# EAGLE schematic i2-mb_r2 (EAGLE 6.5.0)
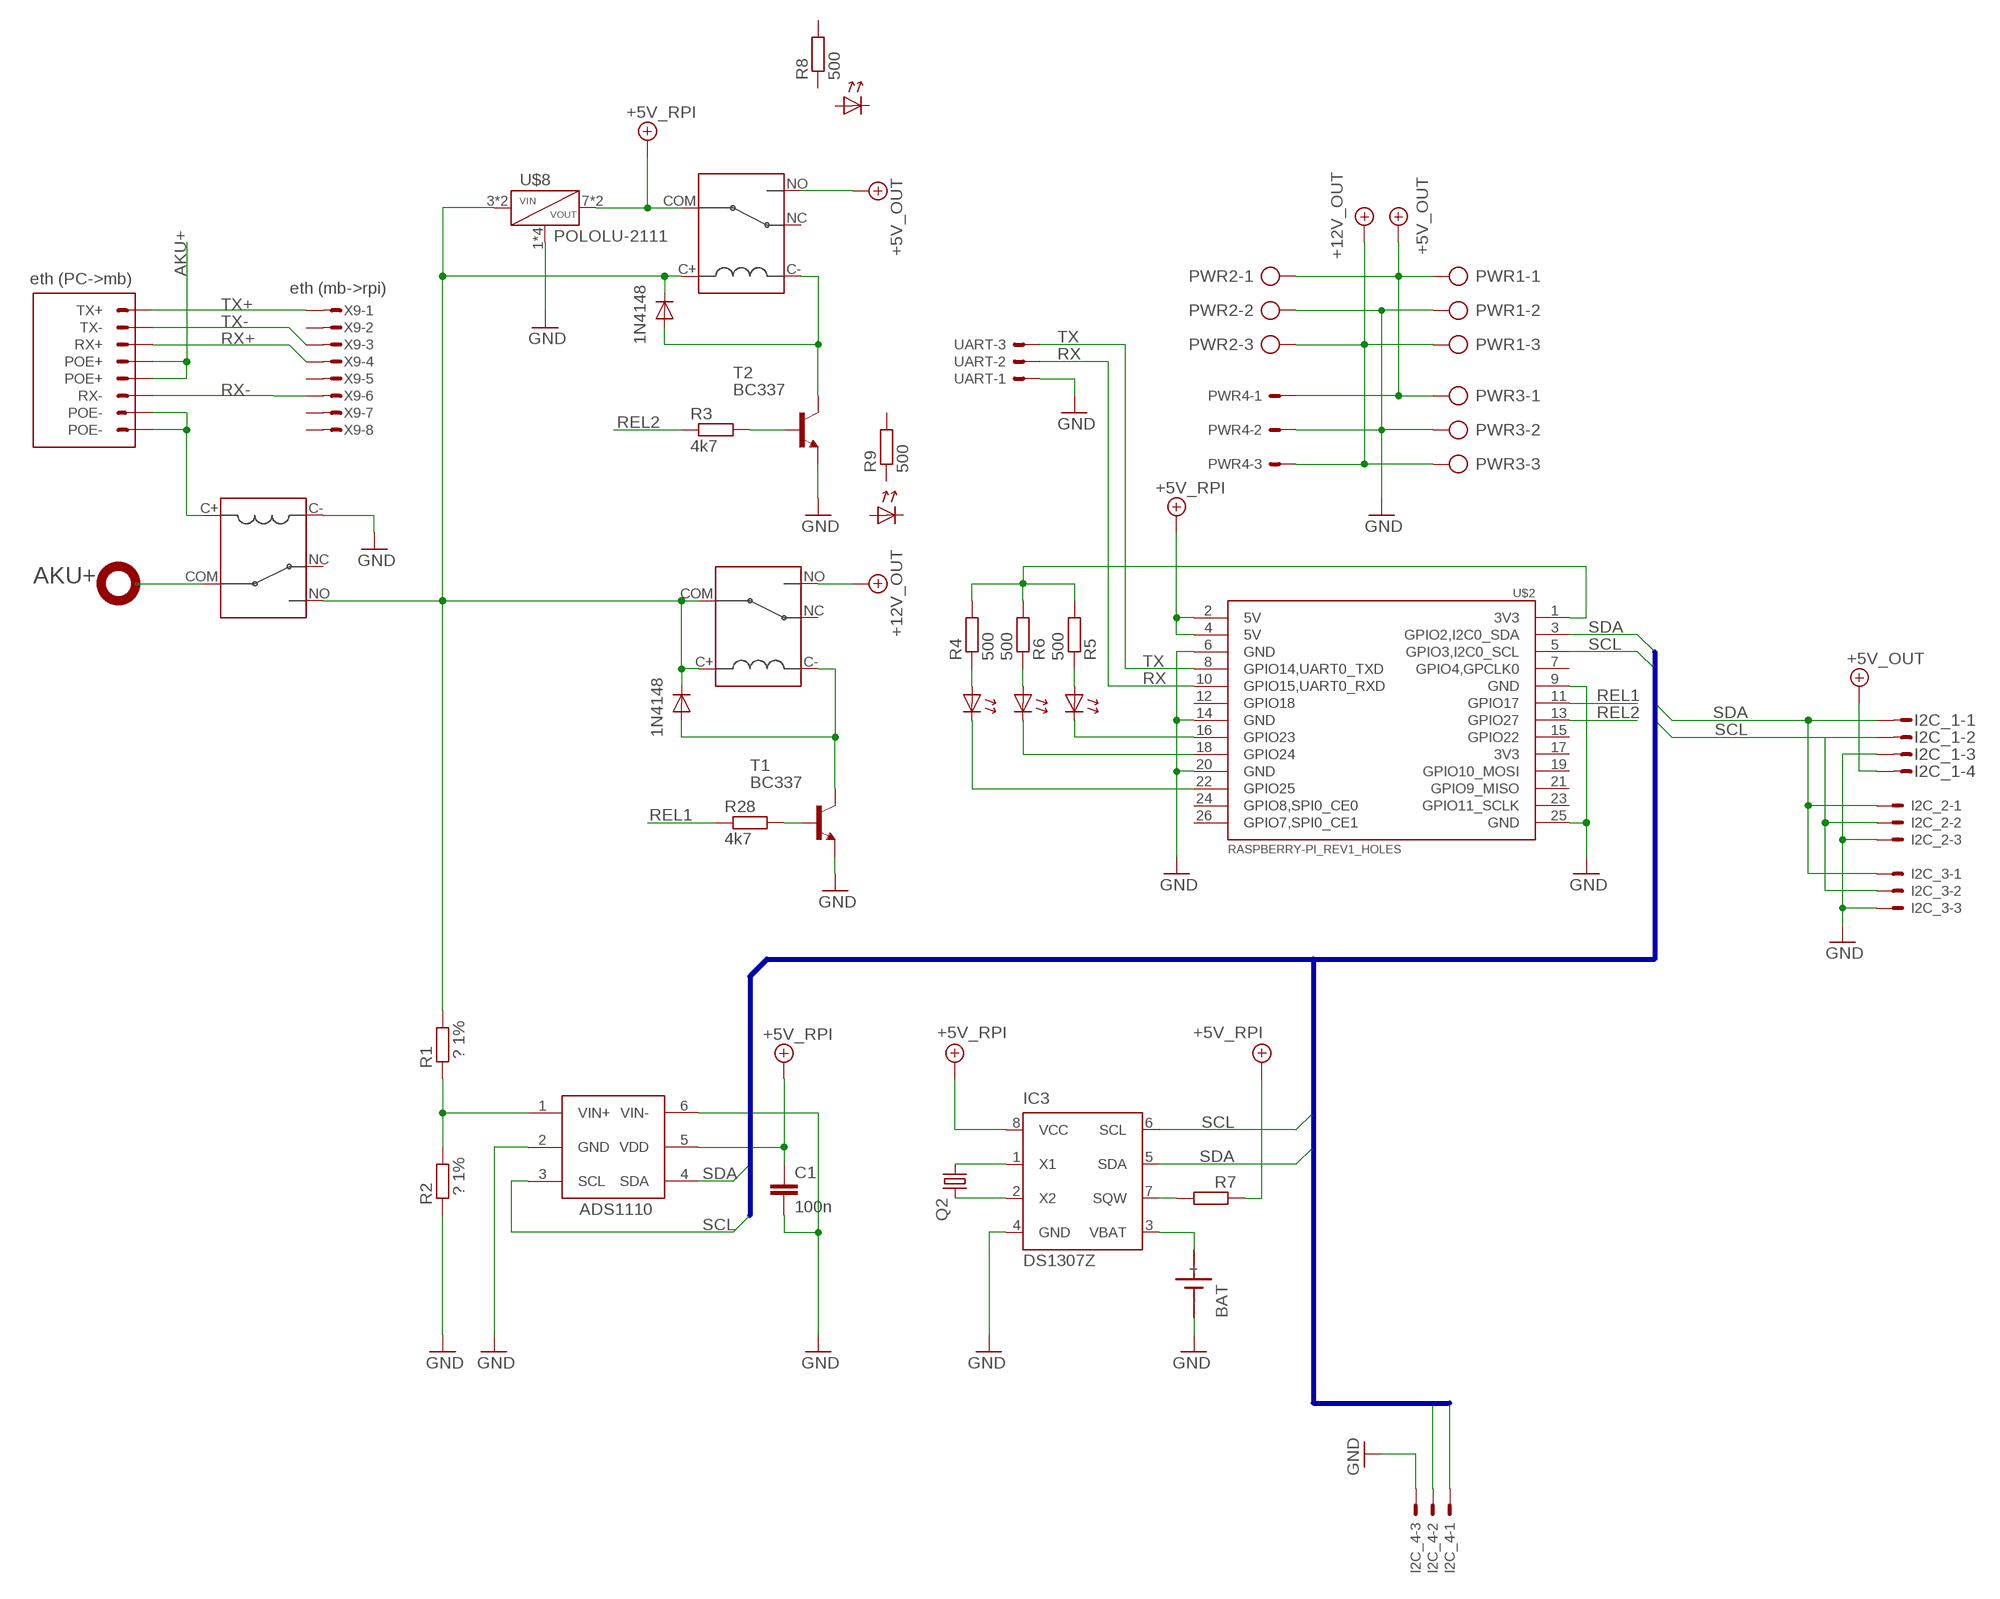
[diagram p0: schematic, sheet 1]

## Parts
BAT  SN2032  [SN2032]
C1  100n  C-EUC0603  [C0603]
I2C_1  MICROMATCH-4  [MICROMATCH-4]
I2C_2  C-GRID-03-70553  [70553-03]
I2C_3  C-GRID-03-70553  [70553-03]
I2C_4  C-GRID-03-70553  [70553-03]
IC1  ADS1110  [SOT-23-6]
IC3  DS1307Z  [SOIC8]
LED1  LED0603  [D0603]
LED2  LED0603  [D0603]
LED3  LED0603  [D0603]
LED4  LED0603  [D0603]
LED5  LED0603  [D0603]
PWR1  TBMP5103RC-KFV1  [TBMP5103RC-KF]
PWR2  TBMP5103RC-KFV1  [TBMP5103RC-KF]
PWR3  TBMP5103RC-KFV1  [TBMP5103RC-KF]
PWR4  C-GRID-03-70543  [70543-03]
Q2  CRYSTAL  [CFPX-217]
R1  ? 1%  R-EU_R0603  [R0603]
R2  ? 1%  R-EU_R0603  [R0603]
R3  4k7  R-EU_R0603  [R0603]
R4  500  R-EU_R0603  [R0603]
R5  500  R-EU_R0603  [R0603]
R6  500  R-EU_R0603  [R0603]
R7  R-EU_R0603  [R0603]
R8  500  R-EU_R0603  [R0603]
R9  500  R-EU_R0603  [R0603]
R28  4k7  R-EU_R0603  [R0603]
T1  BC337  [TO92]
T2  BC337  [TO92]
U$2  RASPBERRY-PI_REV1_HOLES  [RASPBERRY-PI_HOLES]
U$3  1N4148  D0603  [D0603]
U$4  1N4148  D0603  [D0603]
U$5  FBR51  [PC_RELAY]
U$6  FBR51  [PC_RELAY]
U$7  FBR51  [PC_RELAY]
U$8  POLOLU-2111  [POLOLU-2111]
UART  C-GRID-03-70543  [70543-03]
X9  eth (mb->rpi)  MICROMATCH-8  [MICROMATCH-8]
X_ETH  eth (PC->mb)  RJ45  [8P8C-TOP]

## Nets
+5V: I2C_1.4 PWR1.1 PWR2.1 PWR3.1 PWR4.1 U$5.NO ; supply symbol labelled +5V_OUT
+5V_RPI: C1.1 IC1.5(VDD) IC3.8(VCC) R7.1 U$2.2(5V) U$2.4(5V) U$5.COM U$8.7(VOUT) U$8.8(VOUT)
+12V_IN: R1.1 U$3.2(C) U$4.2(C) U$5.C+ U$6.NO U$7.C+ U$7.COM U$8.3(VIN) U$8.4(VIN)
+12V_OUT: PWR1.3 PWR2.3 PWR3.3 PWR4.3 U$7.NO
AKU+: U$6.COM X_ETH.4(POE+) X_ETH.5(POE+)
GND: BAT.- C1.2 I2C_1.3 I2C_2.3 I2C_3.3 I2C_4.3 IC1.2(GND) IC1.6(VIN-) IC3.4(GND) PWR1.2 PWR2.2 PWR3.2 PWR4.2 R2.2 T1.1(E) T2.1(E) U$2.6(GND) U$2.9(GND) U$2.14(GND) U$2.20(GND) U$2.25(GND) U$6.C- U$8.1(GND) U$8.2(GND) U$8.5(GND) U$8.6(GND) UART.1
LED2: LED2.2(C) U$2.16(GPIO23)
LED3: LED3.2(C) U$2.18(GPIO24)
N$1: R3.2 T2.2(B)
N$2: T2.3(C) U$3.1(A) U$5.C-
N$3: BAT.+ IC3.3(VBAT)
N$4: LED2.1(A) R5.1
N$5: LED1.1(A) R4.1
N$6: IC3.1(X1) Q2.1
N$7: LED1.2(C) U$2.22(GPIO25)
N$8: LED3.1(A) R6.1
N$9: IC3.2(X2) Q2.2
N$10: IC3.7(SQW) R7.2
N$11: R4.2 R5.2 R6.2 U$2.1(3V3)
N$33: T1.3(C) U$4.1(A) U$7.C-
N$41: R28.2 T1.2(B)
POE-: U$6.C+ X_ETH.7(POE-) X_ETH.8(POE-)
REL1: R28.1 U$2.11(GPIO17)
REL2: R3.1 U$2.13(GPIO27)
RX: U$2.10(GPIO15,UART0_RXD) UART.2
RX+: X9.4 X_ETH.3(RX+)
RX-: X9.6 X_ETH.6(RX-)
SCL: I2C_1.2 I2C_2.2 I2C_3.2 I2C_4.2 IC1.3(SCL) IC3.6(SCL) U$2.5(GPIO3,I2C0_SCL)
SDA: I2C_1.1 I2C_2.1 I2C_3.1 I2C_4.1 IC1.4(SDA) IC3.5(SDA) U$2.3(GPIO2,I2C0_SDA)
TX: U$2.8(GPIO14,UART0_TXD) UART.3
TX+: X9.1 X_ETH.1(TX+)
TX-: X9.3 X_ETH.2(TX-)
V_SENS: IC1.1(VIN+) R1.2 R2.1
Unconnected: LED4.1(A) LED4.2(C) LED5.1(A) LED5.2(C) R8.1 R8.2 R9.1 R9.2 U$2.7(GPIO4,GPCLK0) U$2.12(GPIO18) U$2.15(GPIO22) U$2.17(3V3) U$2.19(GPIO10_MOSI) U$2.21(GPIO9_MISO) U$2.23(GPIO11_SCLK) U$2.24(GPIO8,SPI0_CE0) U$2.26(GPIO7,SPI0_CE1) U$5.NC U$6.NC U$7.NC X9.2 X9.5 X9.7 X9.8

## Buses
SDA,SCL

## Notes on the sheet
- AKU+

## Library data of the parts
BAT = sn2032:SN2032: LI BATTERY
C1 = rcl:C-EU: CAPACITOR, European symbol
I2C_1 = con-amp-micromatch:MICROMATCH-4: MicroMaTch 4 7-215464-4 / 0-215464-4 Drawing Number C-215464 DDEController.pdf; MPN: 7-215464-4; OC_FARNELL: 3784629; OC_NEWARK: 19R8124
I2C_2-I2C_4 PWR4 UART = con-molex:C-GRID-03: CONNECTOR wire to board 2.54 mm (0.100") pitch header; OC_FARNELL: unknown; OC_NEWARK: unknown
IC1 = ads11xx:ADS1110: Analog/Digital conventer i2c Bus max: 2.048v
IC3 = ds1307_pcf8583:DS1307: I2C-Bus CLOCK/CALENDAR
LED1-LED5 = wb:LED0603
PWR1-PWR3 = con-maritex:TBMP5103RC-KF: 3pin raster 5.08 mm
Q2 = wb:CRYSTAL: CRYSTAL
R1-R9 R28 = rcl:R-EU_: RESISTOR, European symbol
T1 T2 = transistor:BC337: NPN TRANSISTOR
U$2 = RaspberryPi:RASPBERRY-PI_REV1_HOLES: Raspberry Pi Board <http://www.raspberrypi.org/> Jacques Lagnel V1.0 (beta) 2012 Mateusz Bawaj V1.1 (beta) 2012 Board dimension: Forum 3D model <http://www.raspberrypi.org/forum/general-discussion/mechanical-profile-3d-models?value=3d%20model&type=1&include=1&search=1&ret=all> The GPIO Connector (P1): http://elinux.org/RPi_Low-level_peripherals The GPIO Connector (P5): http://www.raspberrypi-spy.co.uk/2012/09/raspberry-pi-p5-header/
U$3 U$4 = wojtkowa:D0603
U$5-U$7 = wb:FBR51
U$8 = pololu:POLOLU-2111: Pololu item #: 2111
X9 = con-maritex:MICROMATCH-8: MicroMaTch 8 7-215464-8 / 0-215464-8 Drawing Number C-215464 DDEController.pdf
X_ETH = con-maritex:RJ45